# Altium schematic sheet 1V8_LDO.SchDoc
size B; SheetNumber: 5; SheetTotal: 5
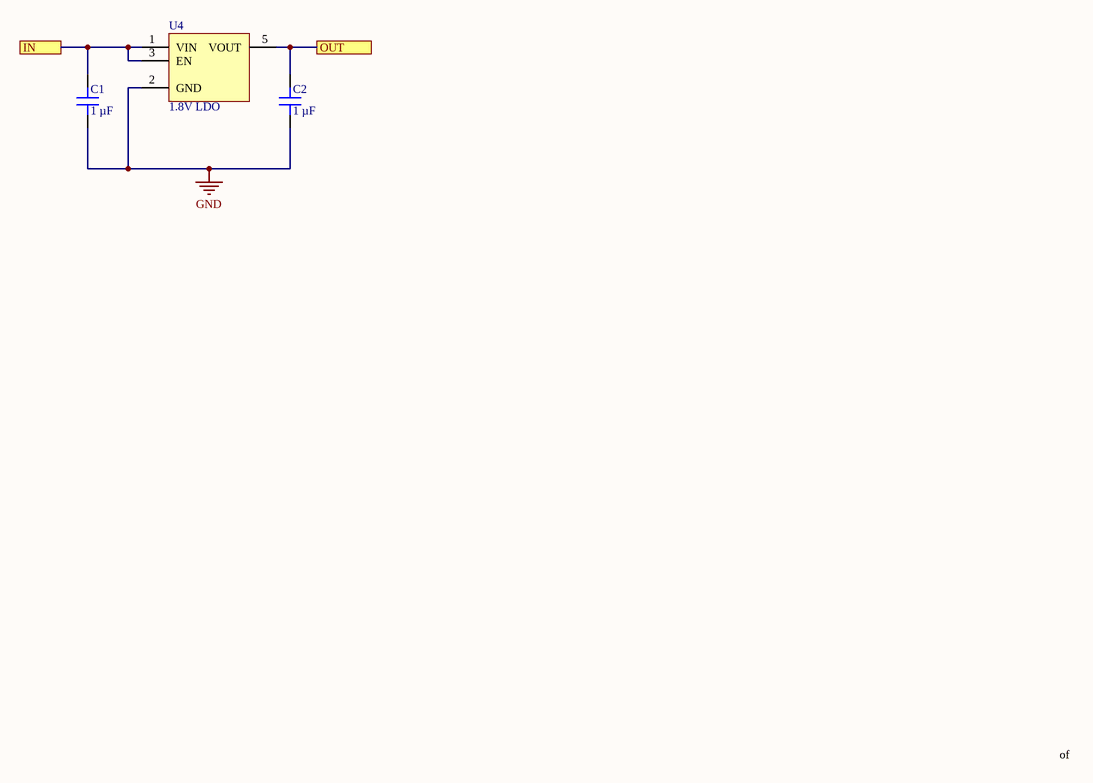
[diagram p0: 1V8_LDO.SchDoc]

## Parts
C1  1 µF  [CAP 0402_1005]
C2  1 µF  [CAP 0402_1005]
U4  1.8V LDO  [TI SOT-23-5 DBV]

## Ports
IN, OUT

## Nets
GND: C1.1 C2.1 U4.2(GND)
IN: C1.2 U4.1(VIN) U4.3(EN) ; port IN
OUT: C2.2 U4.5(VOUT) ; port OUT

## Notes on the sheet
- of

## Library data of the parts
C1 C2 = C0402C104K4RACAUTO: CAP CER 0.1UF 16V X7R 0402; manufacturer: KEMET; Capacitance: 0.1 µF; Tolerance: ±10%; Part Number: C0402C104K4RACAUTO; Value: 1 µF; Applications: Automotive, Bypass, Decoupling; componentlink1description: Datasheet; componentlink1url: https://api.kemet.com/component-edge/download/specsheet/C0402C104K4RACAUTO.pdf; componentlink2description: DigiKey Link; componentlink2url: https://www.digikey.com/en/products/detail/kemet/C0402C104K4RACAUTO/3314827; Device Package: 0402 (1005 Metric); lastupdated: 8/14/2022 9:05:51 PM; Lifecycle Status: Active; Minimum Order: 1; Mounting Type: Surface Mount, MLCC; Operating Temperature: -55°C ~ 125°C; Package / Case: 0402 (1005 Metric); packaging: TapeAndReel; partid: 3024; Part Status: Active; price: 0.01; Ratings: AEC-Q200; series: SMD Auto X7R; Size / Dimension: 0.039" L x 0.020" W (1.00mm x 0.50mm); Supplier 1: DigiKey; Supplier Part Number 1: 399-6828-1-ND; Temperature Coefficient: X7R; Thickness (Max): 0.022" (0.55mm); Voltage - Rated: 16V
U4 = MIC5504-1.8YM5